# EAGLE design atmega32u4-breakout-v3 (EAGLE 6.5.0)
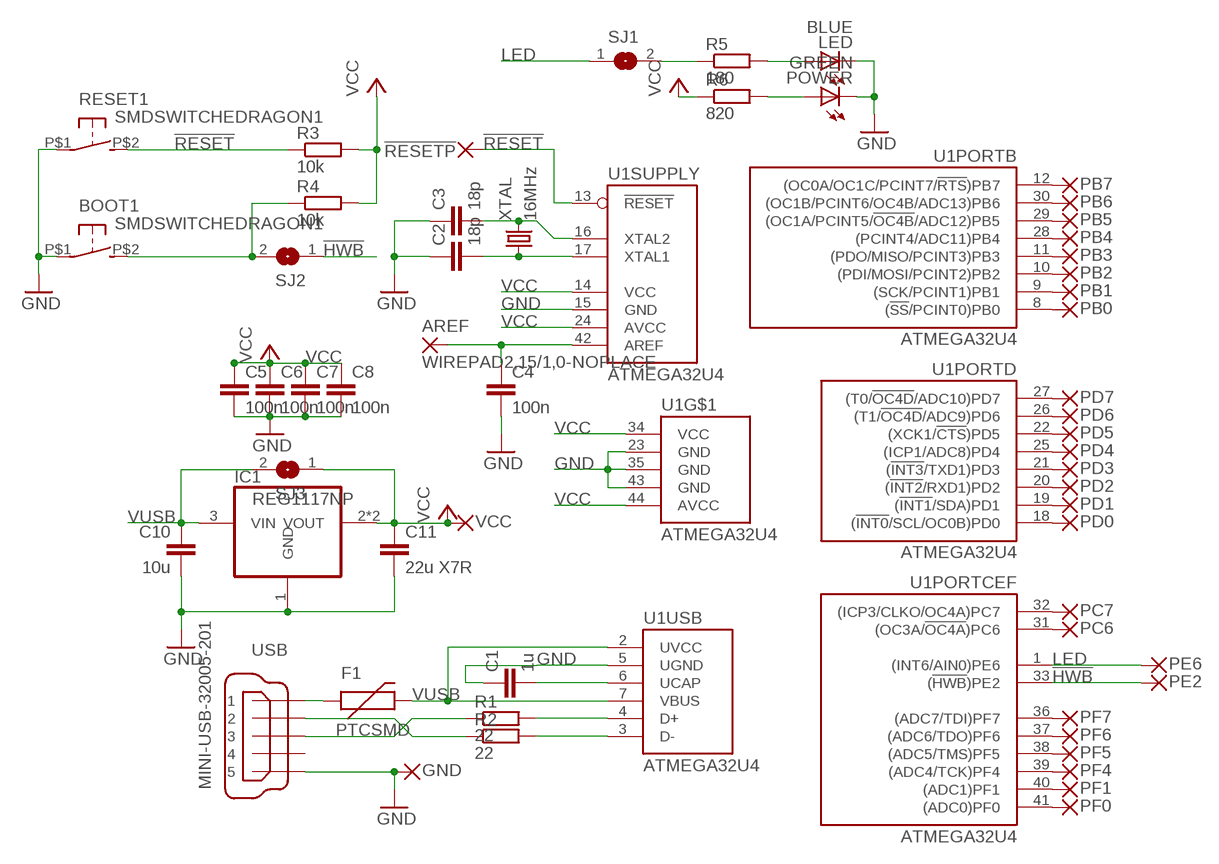
[diagram p0: schematic, sheet 1]

## Parts
!RESETP  WIREPAD2,15/1,0-NOPLACE  [2,15/1,0-NOPLACE]
AREF  WIREPAD2,15/1,0-NOPLACE  [2,15/1,0-NOPLACE]
BOOT1  SMDSWITCHEDRAGON1  [EDRAGON1]
C1  1u  C-EUC0603  [C0603]
C2  18p  C-EUC0603  [C0603]
C3  18p  C-EUC0603  [C0603]
C4  100n  C-EUC0603  [C0603]
C5  100n  C-EUC0603  [C0603]
C6  100n  C-EUC0603  [C0603]
C7  100n  C-EUC0603  [C0603]
C8  100n  C-EUC0603  [C0603]
C10  10u  C-EUC0805K  [C0805K]
C11  22u X7R  C-EUC1206K  [C1206K]
F1  PTCSMD  [PTC-1206]
GND  WIREPAD2,15/1,0-NOPLACE  [2,15/1,0-NOPLACE]
IC1  REG1117NP  [SOT223-NP]
LED  BLUE  LEDCHIPLED_0805  [CHIPLED_0805]
PB0  WIREPAD2,15/1,0-NOPLACE  [2,15/1,0-NOPLACE]
PB1  WIREPAD2,15/1,0-NOPLACE  [2,15/1,0-NOPLACE]
PB2  WIREPAD2,15/1,0-NOPLACE  [2,15/1,0-NOPLACE]
PB3  WIREPAD2,15/1,0-NOPLACE  [2,15/1,0-NOPLACE]
PB4  WIREPAD2,15/1,0-NOPLACE  [2,15/1,0-NOPLACE]
PB5  WIREPAD2,15/1,0-NOPLACE  [2,15/1,0-NOPLACE]
PB6  WIREPAD2,15/1,0-NOPLACE  [2,15/1,0-NOPLACE]
PB7  WIREPAD2,15/1,0-NOPLACE  [2,15/1,0-NOPLACE]
PC6  WIREPAD2,15/1,0-NOPLACE  [2,15/1,0-NOPLACE]
PC7  WIREPAD2,15/1,0-NOPLACE  [2,15/1,0-NOPLACE]
PD0  WIREPAD2,15/1,0-NOPLACE  [2,15/1,0-NOPLACE]
PD1  WIREPAD2,15/1,0-NOPLACE  [2,15/1,0-NOPLACE]
PD2  WIREPAD2,15/1,0-NOPLACE  [2,15/1,0-NOPLACE]
PD3  WIREPAD2,15/1,0-NOPLACE  [2,15/1,0-NOPLACE]
PD4  WIREPAD2,15/1,0-NOPLACE  [2,15/1,0-NOPLACE]
PD5  WIREPAD2,15/1,0-NOPLACE  [2,15/1,0-NOPLACE]
PD6  WIREPAD2,15/1,0-NOPLACE  [2,15/1,0-NOPLACE]
PD7  WIREPAD2,15/1,0-NOPLACE  [2,15/1,0-NOPLACE]
PE2  WIREPAD2,15/1,0-NOPLACE  [2,15/1,0-NOPLACE]
PE6  WIREPAD2,15/1,0-NOPLACE  [2,15/1,0-NOPLACE]
PF0  WIREPAD2,15/1,0-NOPLACE  [2,15/1,0-NOPLACE]
PF1  WIREPAD2,15/1,0-NOPLACE  [2,15/1,0-NOPLACE]
PF4  WIREPAD2,15/1,0-NOPLACE  [2,15/1,0-NOPLACE]
PF5  WIREPAD2,15/1,0-NOPLACE  [2,15/1,0-NOPLACE]
PF6  WIREPAD2,15/1,0-NOPLACE  [2,15/1,0-NOPLACE]
PF7  WIREPAD2,15/1,0-NOPLACE  [2,15/1,0-NOPLACE]
POWER  GREEN  LEDCHIPLED_0805  [CHIPLED_0805]
R1  22  R-EU_R0603  [R0603]
R2  22  R-EU_R0603  [R0603]
R3  10k  R-EU_R0603  [R0603]
R4  10k  R-EU_R0603  [R0603]
R5  180  R-EU_R0603  [R0603]
R6  820  R-EU_R0603  [R0603]
RESET1  SMDSWITCHEDRAGON1  [EDRAGON1]
SJ1  SJ  [SJ]
SJ2  SJ  [SJ]
SJ3  SJNP  [SJNP]
U1  ATMEGA32U4  ATMEGAXU4TQFP44  [TQFP44]
USB  MINI-USB-32005-201  [32005-201]
VCC  WIREPAD2,15/1,0-NOPLACE  [2,15/1,0-NOPLACE]
XTAL  16MHz  CRYSTALABM7  [ABM7]

## Nets
!HWB: PE2.1(P) SJ2.1 U1.33(PORTCEF:(!HWB!)PE2)
!RESET: !RESETP.1(P) R3.1 RESET1.P$2(S) U1.13(SUPPLY:!RESET)
AREF: AREF.1(P) C4.1 U1.42(SUPPLY:AREF)
GND: BOOT1.P$1(P) C1.1 C2.1 C3.1 C4.2 C5.2 C6.2 C7.2 C8.2 C10.2 C11.2 GND.1(P) IC1.1(GND) LED.C POWER.C RESET1.P$1(P) U1.5(USB:UGND) U1.15(SUPPLY:GND) U1.23(GND) U1.35(GND) U1.43(GND) USB.5
LED: PE6.1(P) SJ1.1 U1.1(PORTCEF:(INT6/AIN0)PE6)
MISO: PB3.1(P) U1.11(PORTB:(PDO/MISO/PCINT3)PB3)
MOSI: PB2.1(P) U1.10(PORTB:(PDI/MOSI/PCINT2)PB2)
N$1: R1.1 USB.3
N$2: R2.1 USB.2
N$3: PB0.1(P) U1.8(PORTB:(!SS!/PCINT0)PB0)
N$4: F1.1 USB.1
N$5: C2.2 U1.17(SUPPLY:XTAL1) XTAL.P$1
N$6: C3.2 U1.16(SUPPLY:XTAL2) XTAL.P$2
N$7: C1.2 U1.6(USB:UCAP)
N$8: POWER.A R6.2
N$9: R1.2 U1.4(USB:D+)
N$10: R2.2 U1.3(USB:D-)
N$11: R5.1 SJ1.2
N$12: PD5.1(P) U1.22(PORTD:(XCK1/!CTS!)PD5)
N$13: PB4.1(P) U1.28(PORTB:(PCINT4/ADC11)PB4)
N$14: PB5.1(P) U1.29(PORTB:(OC1A/PCINT5/!OC4B!/ADC12)PB5)
N$15: PF0.1(P) U1.41(PORTCEF:(ADC0)PF0)
N$16: PF1.1(P) U1.40(PORTCEF:(ADC1)PF1)
N$17: PF4.1(P) U1.39(PORTCEF:(ADC4/TCK)PF4)
N$18: PF5.1(P) U1.38(PORTCEF:(ADC5/TMS)PF5)
N$19: PF6.1(P) U1.37(PORTCEF:(ADC6/TDO)PF6)
N$20: PF7.1(P) U1.36(PORTCEF:(ADC7/TDI)PF7)
N$21: BOOT1.P$2(S) R4.1 SJ2.2
N$22: LED.A R5.2
N$23: PC6.1(P) U1.31(PORTCEF:(OC3A/!OC4A!)PC6)
N$24: PC7.1(P) U1.32(PORTCEF:(ICP3/CLKO/OC4A)PC7)
N$25: PB6.1(P) U1.30(PORTB:(OC1B/PCINT6/OC4B/ADC13)PB6)
N$26: PB7.1(P) U1.12(PORTB:(OC0A/OC1C/PCINT7/!RTS!)PB7)
N$27: PD0.1(P) U1.18(PORTD:(!INT0!/SCL/OC0B)PD0)
N$28: PD1.1(P) U1.19(PORTD:(!INT1!/SDA)PD1)
N$29: PD2.1(P) U1.20(PORTD:(!INT2!/RXD1)PD2)
N$30: PD3.1(P) U1.21(PORTD:(!INT3!/TXD1)PD3)
N$31: PD4.1(P) U1.25(PORTD:(ICP1/ADC8)PD4)
N$33: PD6.1(P) U1.26(PORTD:(T1/!OC4D!/ADC9)PD6)
N$34: PD7.1(P) U1.27(PORTD:(T0/!OC4D!/ADC10)PD7)
SCK: PB1.1(P) U1.9(PORTB:(SCK/PCINT1)PB1)
VCC: C5.1 C6.1 C7.1 C8.1 C11.1 IC1.2(VOUT) IC1.4(VOUT) R3.2 R4.2 R6.1 SJ3.1 U1.14(SUPPLY:VCC) U1.24(SUPPLY:AVCC) U1.34(VCC) U1.44(AVCC) VCC.1(P)
VUSB: C10.1 F1.2 IC1.3(VIN) SJ3.2 U1.2(USB:UVCC) U1.7(USB:VBUS)
Unconnected: USB.4

## Library data of the parts
!RESETP AREF GND PB0 PB1-PB7 PC6 PC7 PD0 PD1-PD7 PE2 PE6 PF0 PF1 PF4-PF7 VCC = jocki:WIREPAD: Wire PAD connect wire on PCB
BOOT1 RESET1 = jocki:SMDSWITCH
C1-C8 C10 C11 = rcl:C-EU: CAPACITOR, European symbol
F1 = SparkFun-PowerIC:PTC: Resettable Fuse PTC Resettable Fuse. Spark Fun Electronics SKU : COM-08357; PROD_ID: RES-11150
IC1 = burr-brown:REG1117: 800mA and 1A Low Dropout (LDO) Positive Regulator 1.8V, 2.5V, 2.85V, 3.3V, 5V, and Adj
LED POWER = led:LED: LED OSRAM: - CHIPLED LG R971, LG N971, LY N971, LG Q971, LY Q971, LO R971, LY R971 LH N974, LH R974 LS Q976, LO Q976, LY Q976 LO Q996 - Hyper CHIPLED LW Q18S LB Q993, LB Q99A, LB R99A - SideLED LS A670, LO A670, LY A670, LG A670, LP A670 LB A673, LV A673, LT A673, LW A673 LH A674 LY A675 LS A676, LA A676, LO A676, LY A676, LW A676 LS A679, LY A679, LG A679 - Hyper Micro SIDELED® LS Y876, LA Y876, LO Y876, LY Y876 LT Y87S - SmartLED LW L88C, LW L88S LB L89C, LB L89S, LG L890 LS L89K, LO L89K, LY L89K LS L896, LA L896, LO L896, LY L896 - TOPLED LS T670, LO T670, LY T670, LG T670, LP T670 LSG T670, LSP T670, LSY T670, LOP T670, LYG T670 LG T671, LOG T671, LSG T671 LB T673, LV T673, LT T673, LW T673 LH T674 LS T676, LA T676, LO T676, LY T676, LB T676, LH T676, LSB T676, LW T676 LB T67C, LV T67C, LT T67C, LS T67K, LO T67K, LY T67K, LW E67C LS E67B, LA E67B, LO E67B, LY E67B, LB E67C, LV E67C, LT E67C LW T67C LS T679, LY T679, LG T679 LS T770, LO T770, LY T770, LG T770, LP T770 LB T773, LV T773, LT T773, LW T773 LH T774 LS E675, LA E675, LY E675, LS T675 LS T776, LA T776, LO T776, LY T776, LB T776 LHGB T686 LT T68C, LB T68C - Hyper Mini TOPLED® LB M676 - Mini TOPLED Santana® LG M470 LS M47K, LO M47K, LY M47K Source: http://www.osram.convergy.de LUXEON: - LUMILED® LXK2-PW12-R00, LXK2-PW12-S00, LXK2-PW14-U00, LXK2-PW14-V00 LXK2-PM12-R00, LXK2-PM12-S00, LXK2-PM14-U00 LXK2-PE12-Q00, LXK2-PE12-R00, LXK2-PE12-S00, LXK2-PE14-T00, LXK2-PE14-U00 LXK2-PB12-K00, LXK2-PB12-L00, LXK2-PB12-M00, LXK2-PB14-N00, LXK2-PB14-P00, LXK2-PB14-Q00 LXK2-PR12-L00, LXK2-PR12-M00, LXK2-PR14-Q00, LXK2-PR14-R00 LXK2-PD12-Q00, LXK2-PD12-R00, LXK2-PD12-S00 LXK2-PH12-R00, LXK2-PH12-S00 LXK2-PL12-P00, LXK2-PL12-Q00, LXK2-PL12-R00 Source: www.luxeon.com KINGBRIGHT: KA-3528ASYC Source: www.kingbright.com
R1-R6 = rcl:R-EU_: RESISTOR, European symbol
SJ1-SJ3 = jumper:SJ: SMD solder JUMPER
U1 = jocki:ATMEGAXU4: Atmel Atmega16U4 or Atmega32U4
USB = jocki:MINI-USB-: MINI USB-B Conector Source: www.cypressindustries.com
XTAL = jocki:CRYSTAL

## Board
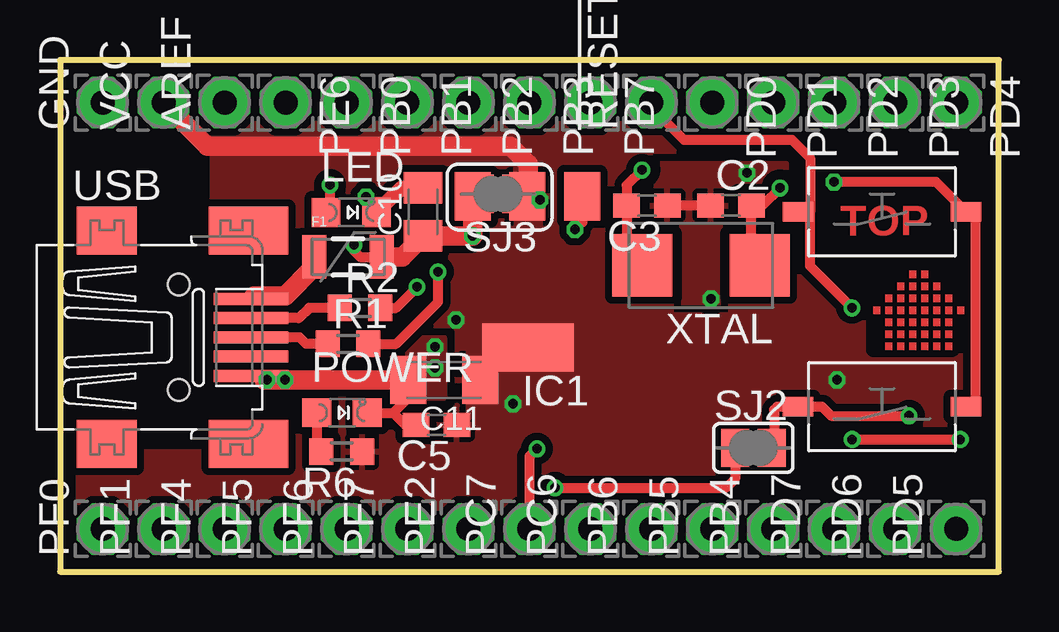
[diagram p1: board, top side]
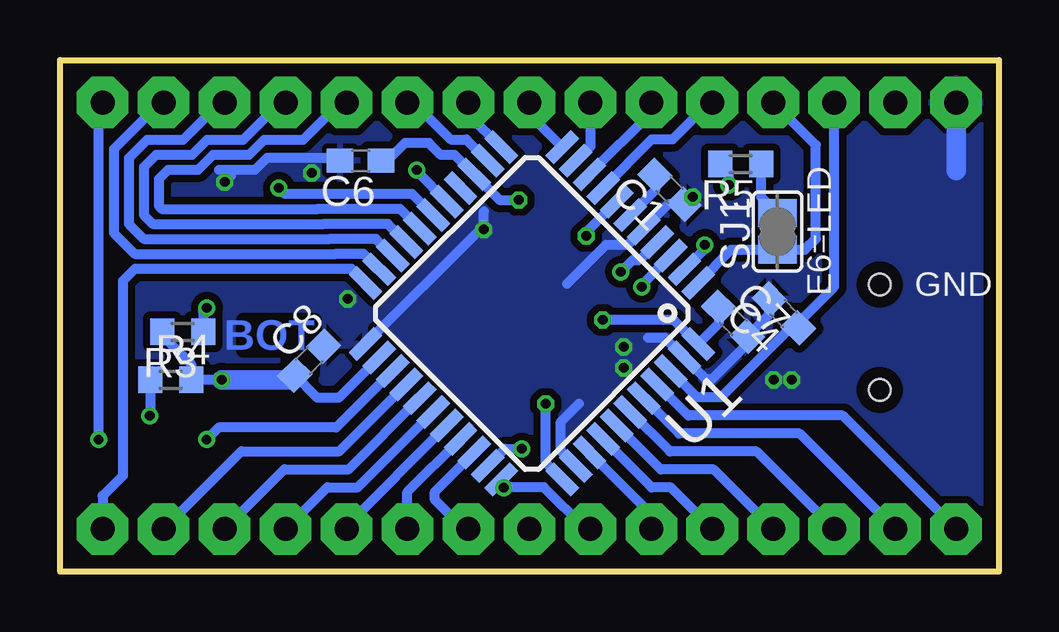
[diagram p2: board, bottom side, seen from below]

Size 39.12 x 21.34 mm. Coordinates in mm from the lower left corner, seen from the top.
Outline: 0,0 39.12,0 39.12,21.34 0,21.34 0,0
Copper layers (1*16): Top 0.035mm / dielectric 1.5mm / Bottom 0.035mm
Design rules "multi-cb_035um-cu *": minimum track width 6mil, minimum drill 12mil, track to track 6mil, track to pad 6mil, pad to pad 6mil, via to via 6mil, smd to smd 0mil, copper to edge 20mil, drill to drill 8mil, minimum pad ring 8mil, minimum via ring 6mil, stop-mask expansion 3mil, vias tented up to drill 0mil, thermal gap 8mil
tRestrict: area 33.9,9.2 to 35.6,11; area 0.8,5.6 to 5.9,14

### Footprints (pad centres in the part's own frame; a part is rotated, then mirrored left to right if it is on the bottom)
2,15/1,0-NOPLACE = drill 1 pad 2.15 octagon: 1 0,0
EDRAGON1 = smd 1.27 x 0.8: P$1 3.5,0; P$2 -3.5,0
C0603 = smd 1.1 x 1: 1 -0.85,0; 2 0.85,0
C0805K = smd 1.3 x 1.6: 1 -1,0; 2 1,0
C1206K = smd 1.5 x 2: 1 -1.5,0; 2 1.5,0
PTC-1206 = smd 1 x 1.8: 1 -1.4,0; 2 1.4,0
SOT223-NP = smd 1.499 x 2.007: 1 -2.261,-3.15; 2 0.025,-3.15; 3 2.311,-3.15 | smd 3.81 x 2.007: 4 0,3.15
CHIPLED_0805 = smd 1.2 x 1.2: A 0,-1.05; C 0,1.05
R0603 = smd 1 x 1.1: 1 -0.85,0; 2 0.85,0
SJ = smd 1.168 x 1.6: 1 -0.762,0; 2 0.762,0
SJNP = smd 1.168 x 1.6: 1 -0.762,0; 2 0.762,0
TQFP44 = smd 1.5 x 0.5: 1 -5.8,4; 2 -5.8,3.2; 3 -5.8,2.4; 4 -5.8,1.6; 5 -5.8,0.8; 6 -5.8,0; 7 -5.8,-0.8; 8 -5.8,-1.6; 9 -5.8,-2.4; 10 -5.8,-3.2; 11 -5.8,-4; 23 5.8,-4; 24 5.8,-3.2; 25 5.8,-2.4; 26 5.8,-1.6; 27 5.8,-0.8; 28 5.8,0; 29 5.8,0.8; 30 5.8,1.6; 31 5.8,2.4; 32 5.8,3.2; 33 5.8,4 | smd 0.5 x 1.5: 12 -4,-5.8; 13 -3.2,-5.8; 14 -2.4,-5.8; 15 -1.6,-5.8; 16 -0.8,-5.8; 17 0,-5.8; 18 0.8,-5.8; 19 1.6,-5.8; 20 2.4,-5.8; 21 3.2,-5.8; 22 4,-5.8; 34 4,5.8; 35 3.2,5.8; 36 2.4,5.8; 37 1.6,5.8; 38 0.8,5.8; 39 0,5.8; 40 -0.8,5.8; 41 -1.6,5.8; 42 -2.4,5.8; 43 -3.2,5.8; 44 -4,5.8
32005-201 = smd 3.1 x 0.5: 1 3,1.6; 2 3,0.8; 3 3,0; 4 3,-0.8; 5 3,-1.6 | smd 2.5 x 2: M1 -3,-4.45; M2 -3,4.45 | smd 3.3 x 2: M3 2.9,4.45; M4 2.9,-4.45 | hole 0.9: 0,2.2; 0,-2.2
ABM7 = smd 2.5 x 2.6: P$1 -2.45,0; P$2 2.45,0

### Placement (x,y rotation side)
!RESETP  24.64,19.56 90 top
AREF  6.86,19.56 90 top
BOOT1  34.25,6.88 0 top
C1  13.72,15.92 135 bottom
C2  27.96,15.27 0 top
C3  24.46,15.27 180 top
C4  8.96,10.77 135 bottom
C5  15.69,6.12 180 top
C6  26.59,17.14 180 bottom
C7  11.07,10.42 315 bottom
C8  28.73,8.8 45 bottom
C10  15.12,15 90 top
C11  16,8 180 top
F1  12,13.12 0 top
GND  1.78,19.56 90 top
IC1  19.5,12.5 180 top
LED  12.14,14.98 270 top
PB0  11.94,19.56 270 top
PB1  14.48,19.56 270 top
PB2  17.02,19.56 270 top
PB3  19.56,19.56 270 top
PB4  29.72,1.78 90 top
PB5  27.18,1.78 90 top
PB6  24.64,1.78 90 top
PB7  22.1,19.56 270 top
PC6  22.1,1.78 90 top
PC7  19.56,1.78 90 top
PD0  27.18,19.56 270 top
PD1  29.72,19.56 270 top
PD2  32.26,19.56 270 top
PD3  34.8,19.56 270 top
PD4  37.34,19.56 270 top
PD5  37.34,1.78 90 top
PD6  34.8,1.78 90 top
PD7  32.26,1.78 90 top
PE2  17.02,1.78 90 top
PE6  9.4,19.56 270 top
PF0  1.78,1.78 90 top
PF1  4.32,1.78 90 top
PF4  6.86,1.78 90 top
PF5  9.4,1.78 90 top
PF6  11.94,1.78 90 top
PF7  14.48,1.78 90 top
POWER  11.75,6.62 270 top
R1  12,9.5 0 top
R2  12.5,11 0 top
R3  34,10 180 bottom
R4  34.5,8 0 bottom
R5  10.75,17 180 bottom
R6  11.74,5.01 180 top
RESET1  34.25,15 0 top
SJ1  9.22,14.18 90 bottom
SJ2  28.89,5.16 0 top
SJ3  18.25,15.75 180 top
U1  19.46,10.77 225 bottom
USB  4.96,9.77 0 top
VCC  4.32,19.56 90 top
XTAL  26.71,12.77 180 top

### Tracks (layer width: path | path; a pad name or v marks a point on that pad's centre or on a via)
!HWB  (via drill 0.4)
  Top 0.406: v20.62,3.5 27.75,3.5 28.13,3.88 SJ2.1
  Bottom 0.406: PE2.1 17.22,1.78 18.96,3.52 20.41,3.52 | 20.41,3.52 U1.33 | 20.41,3.52 20.61,3.52 v20.62,3.5
!RESET  (via drill 0.4)
  Top 0.406: !RESETP.1 24.64,19.36 26,18 30.5,18 31.25,17.25 31.25,15 | 31.25,15 RESET1.P$2 | 31.25,15.38 31.25,15 | v33,11 31.25,12.75 31.25,15
  Bottom 0.406: U1.13 22.18,18.02 22.83,18.02 24.37,19.56 !RESETP.1 | v33,11 33.15,10.85 R3.1
AREF
  Bottom 0.406: 8.68,10.18 8.58,10.27 8.49,10.36 8.36,10.36 | 8.68,10.18 11.58,7.27 12.56,7.27 U1.42 | 8.46,10.27 8.36,10.36 | 8.36,10.36 6.86,11.87 AREF.1 | C4.1 8.67,10.17 8.68,10.18
GND  (via drill 0.4)
  Top 0.406: C2.1 C3.1 | 8.08,8.17 USB.5 8.33,8.17 8.5,8 | IC1.1 21.76,14.57 v21.46,14.27 | RESET1.P$1 37.88,15.12 | RESET1.P$1 38.12,15 38.12,6.88 BOOT1.P$1 | POWER.C 13.88,6.62 | 13.88,6.62 14.38,6.12 C5.2 | 13.88,6.62 14.5,7.25 C11.2 | RESET1.P$1 36.5,16.25 v32.25,16.25 | v12.75,15.62 13.19,15.19 LED.C
  Top 0.61: C10.2 14.21,16 13.53,15.32 C1.1 13.19,15.25 LED.C
  Top 0.813: C11.2 v8.62,8 8.5,8
  Bottom 0.406: 21.46,15.03 v21.46,14.27 21.61,14.27 U1.23 26.39,9.53 | 12.18,8.02 11.96,8.02 10.47,9.51 C7.2 9.56,10.72 C4.2 | 12.18,8.02 U1.43 13.91,9.75 14.62,9.75 | 12.18,8.02 | 18,12 16.38,13.62 15.47,13.62 U1.5 13.78,15.32 C1.1 | 27.8,17.25 30.5,17.25 31,16.75 32,16.75 | 32,16.75 32.5,16.75 | U1.35 18.25,5.04 18.25,6.25 17.5,7 | v32.25,16.25 32,16.5 32,16.75
  Bottom 0.813: GND.1 1.78,16.72
  other vias: 9.38,8 15.62,9.38 15.62,8.5 27.12,11.38 28.62,16.62
  pour Bottom (isolate 0.305): 0,0 39.12,0 39.12,21.34 0,21.34
  pour Top (isolate 0.406): 23.12,17 23.12,11.25 30.25,11.25 30.25,17
  pour Top (isolate 0.305, no thermals): 14.5,9.75 16,9.75 16,7.25 14.5,7.25
LED
  Bottom 0.406: U1.1 11.15,13.42 SJ1.1 8.08,13.42 7.62,13.88 7.62,17.79 PE6.1
MISO
  Bottom 0.406: PB3.1 19.56,19.07 U1.11
MOSI
  Bottom 0.406: PB2.1 17.02,17.73 U1.10
N$1
  Top 0.406: R1.1 10.25,9.5 9.98,9.77 USB.3
N$2
  Top 0.406: R2.1 10.38,11 9.94,10.57 USB.2
N$3
  Bottom 0.406: U1.8 14.47,18.02 13.6,18.02 12.06,19.56 PB0.1
N$4
  Top 0.406: 8.09,11.5 USB.1
  Top 0.813: 8.09,11.5 9.38,11.5 10.6,12.72 F1.1
N$5  (via drill 0.4)
  Top 0.406: XTAL.P$1 29.18,12.79 28.81,13.17 C2.2 29.27,15.27 v30,16
  Bottom 0.406: U1.17 24.44,15.75 28.38,15.75 29.38,15.75 29.75,15.75 v30,16
N$6  (via drill 0.4)
  Top 0.406: v24.25,16.75 23.61,16.11 C3.2 23.61,13.42 XTAL.P$2
  Bottom 0.406: v24.25,16.75 24.25,16.69 U1.16
N$7
  Bottom 0.406: C1.2 14.32,15.91 U1.6
N$8
  Top 0.406: POWER.A 10.7,5.2 R6.2
N$9  (via drill 0.4)
  Top 0.406: v15.75,12.5 15.75,11.25 14,9.5 R1.2
  Bottom 0.406: v15.75,12.5 15.25,13 14.96,13 U1.4
N$10  (via drill 0.4)
  Top 0.406: R2.2 14,11 v14.88,11.88
  Bottom 0.406: v14.88,11.88 14.88,11.96 U1.3
N$11
  Bottom 0.406: SJ1.2 9.9,15.62 R5.1
N$12
  Bottom 0.406: PD5.1 37.34,3.16 36.5,4 36.5,11 36.5,12.12 36,12.62 26.97,12.62 U1.22
N$13
  Bottom 0.406: PB4.1 27.98,3.52 26.71,3.52 U1.28
N$14
  Bottom 0.406: PB5.1 27.18,1.92 U1.29
N$15
  Bottom 0.406: PF0.1 6.51,6.51 12.94,6.51 U1.41
N$16
  Bottom 0.406: PF1.1 8.3,5.76 13.32,5.76 U1.40
N$17
  Bottom 0.406: PF4.1 10.09,5.01 13.7,5.01 U1.39
N$18
  Bottom 0.406: PF5.1 11.88,4.26 14.08,4.26 U1.38
N$19
  Bottom 0.406: PF6.1 13.67,3.51 14.46,3.51 U1.37
N$20
  Bottom 0.406: PF7.1 14.48,2.39 U1.36
N$21  (via drill 0.4)
  Top 0.406: v35.38,6.5 32.12,6.5 31.75,6.88 BOOT1.P$2 29.88,6.88 29.75,6.75 29.75,5.26 SJ2.2
  Bottom 0.406: R4.1 35.35,6.53 v35.38,6.5
N$22  (via drill 0.4)
  Top 0.406: LED.A 11.25,15.14 v11.25,16.12
  Bottom 0.406: R5.2 11.25,16.65 v11.25,16.12
N$23
  Bottom 0.406: PC6.1 22.28,1.78 23.5,3 23.5,3.33 U1.31
N$24  (via drill 0.4)
  Top 0.406: v19.88,5.12 19.56,4.81 PC7.1
  Bottom 0.406: U1.32 20.58,5.12 v19.88,5.12
N$25
  Bottom 0.406: PB6.1 24.64,3.33 U1.30
N$26
  Bottom 0.406: PB7.1 22.1,19.07 U1.12
N$27
  Bottom 0.406: U1.18 24.95,15.12 27.62,15.12 28.38,15.12 34.88,15.12 35,15.25 35,16.38 34.62,16.75 33.38,16.75 32.75,17.38 31.25,17.38 30.62,18 29,18 27.44,19.56 PD0.1
N$28
  Bottom 0.406: U1.19 25.45,14.5 27.38,14.5 28.12,14.5 35.25,14.5 35.62,14.88 35.62,16.88 35.12,17.38 33.62,17.38 33,18 31.5,18 29.94,19.56 PD1.1
N$29
  Bottom 0.406: U1.20 25.96,13.88 27.12,13.88 27.88,13.88 35.62,13.88 36.25,14.5 36.25,17.25 35.5,18 34,18 32.44,19.56 PD2.1
N$30
  Bottom 0.406: U1.21 26.46,13.25 26.88,13.25 27.62,13.25 36,13.25 36.88,14.12 36.88,17.62 34.94,19.56 PD3.1
N$31  (via drill 0.4)
  Top 0.406: v33.01,5.51 v37.51,5.51
  Bottom 0.406: U1.25 27.61,6.01 32.51,6.01 v33.01,5.51 | v37.51,5.51 37.51,19.39 PD4.1
N$33
  Bottom 0.406: PD6.1 31.56,5.02 27.47,5.02 U1.26
N$34
  Bottom 0.406: PD7.1 29.77,4.27 27.09,4.27 U1.27
SCK
  Bottom 0.406: PB1.1 14.48,19.14 U1.9
VCC  (via drill 0.4)
  Top 0.406: v20,15.5 19.85,15.65 IC1.2
  Top 0.813: IC1.2 19.5,15.68 19.5,17 18.75,17.75 6.52,17.75 6.13,17.75 VCC.1
  Bottom 0.406: U1.34 18.88,4.53 v18.88,7 | v20,15.5 20.8,15.5 U1.14 22.67,17.38 23.25,17.38 23.75,17.88 24.75,17.88 25.48,17.14 C6.1 | v16.5,10.5 13.53,10.5 U1.44 11.67,10.36 C7.1 | v32.38,8 32.5,8 R4.2 33.65,8.65 34.5,9.5 34.85,9.85 R3.2 | U1.24 27.5,7.25 27.75,7.25 28.39,7.25 C8.1
  Bottom 0.813: v32.38,8 29.53,8 C8.1
  pour Top (isolate 0.305, rank 2): 0,0 39.12,0 39.12,21.34 6.35,21.34 6.35,14.35 0,14.35
  pour Top (isolate 0.305, no thermals): 20,16.5 19,16.5 19,14 17,14 17,6.5 22,6.5 22,14 20,14
VUSB  (via drill 0.4)
  Top 0.406: v12.25,13.62 12.25,13.38 12.5,13.12 F1.2
  Top 0.813: SJ3.2 17.49,15.65 IC1.3 v17.19,14 C10.1 14.25,13.12 F1.2
  Bottom 0.406: v12.25,13.62 12.25,13.45 U1.2 | U1.7 17.19,14.17 v17.19,14
(copper drawn outside any net)
  shapes: Top area x38

### Text on the board
Top: TOP
Bottom: BOT
bPlace: GND | E6=LED
Reference: GND | VDD | VREF | 0 | B | 1 | 2 | 3 | 7 | !RST | 0 | D | 1 | 2 | 3 | 4 | E6 | VDD / =VUSB | @dop3j0e | RESET | PWR | BOOT | E2= / BOOT | F | C | B | D | 0 | 1 | 4 | 5 | 6 | 7 | E2 | 7 | 6 | 6 | 5 | 4 | 7 | 6 | 5